# Altium schematic sheet analog_10V_sensors.SchDoc
size A4; SheetNumber: 6; SheetTotal: 12
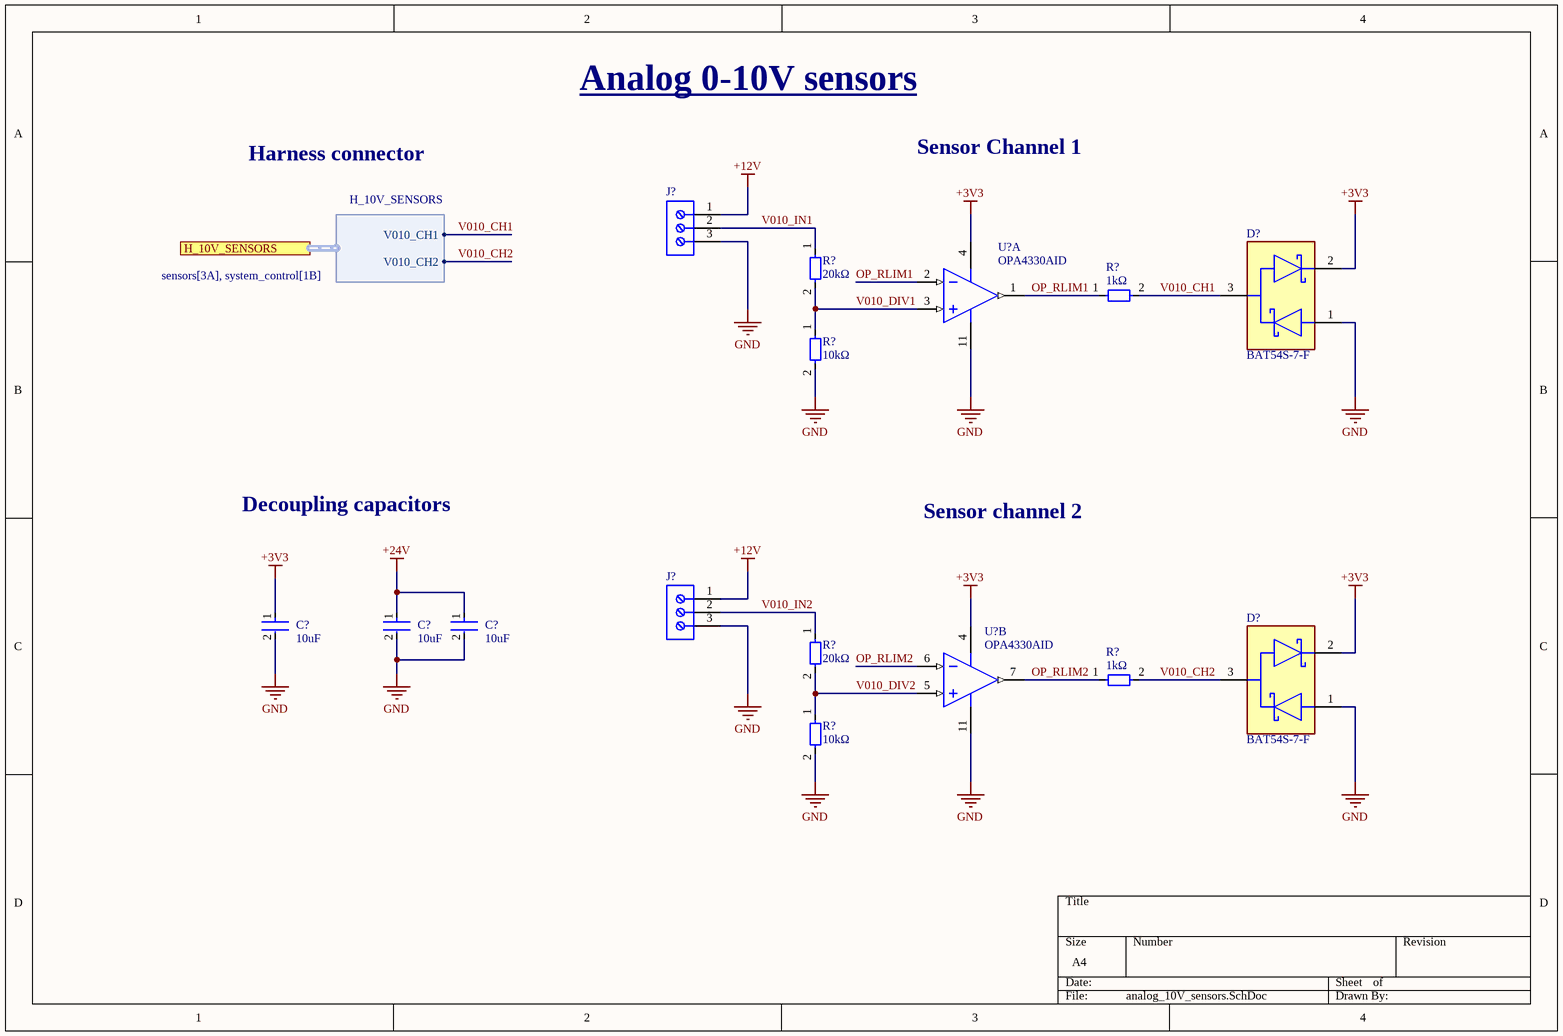
[diagram p0: analog_10V_sensors.SchDoc]

## Parts
(Parts that share a designator on the sheet are numbered #1, #2 ... from top to bottom, then left to right.)
C?#1  Capacitance: 10uF  [CAP_0805]  (hidden comment: Simbolo de capacitor genérico)
C?#2  Capacitance: 10uF  [CAP_0805]  (hidden comment: Simbolo de capacitor genérico)
C?#3  Capacitance: 10uF  [CAP_0805]  (hidden comment: Simbolo de capacitor genérico)
D?#1  BAT54S-7-F  [FP-SOT23-MFG]
D?#2  BAT54S-7-F  [FP-SOT23-MFG]
J?#1  691137710003  [691137710003]  (value not drawn)
J?#2  691137710003  [691137710003]  (value not drawn)
R?#1  value 20kΩ  [RES_0805]  (hidden comment: Simbolo de resistencia genérica)
R?#2  value 1kΩ  [RES_0805]  (hidden comment: Simbolo de resistencia genérica)
R?#3  value 10kΩ  [RES_0805]  (hidden comment: Simbolo de resistencia genérica)
R?#4  value 20kΩ  [RES_0805]  (hidden comment: Simbolo de resistencia genérica)
R?#5  value 1kΩ  [RES_0805]  (hidden comment: Simbolo de resistencia genérica)
R?#6  value 10kΩ  [RES_0805]  (hidden comment: Simbolo de resistencia genérica)
U?#1  OPA4330AID  [D0014A_N]  (part A of 4)
U?#2  OPA4330AID  [D0014A_N]  (part B of 4)

## Ports
H_10V_SENSORS (harness H_10V_SENSORS, see sensors[3A], system_control[1B])

## Harnesses
H_10V_SENSORS: V010_CH1, V010_CH2

## Nets
+3V3: C?#1.1 D?#1.2 D?#2.2 U?#1.4(V+) U?#2.4(V+)
+12V: J?#1.1 J?#2.1
+24V: C?#2.1 C?#3.1
GND: C?#1.2 C?#2.2 C?#3.2 D?#1.1 D?#2.1 J?#1.3 J?#2.3 R?#3.2 R?#6.2 U?#1.11(V-) U?#2.11(V-)
OP_RLIM1: R?#2.1 U?#1.1(OUT_A) U?#1.2(IN_A-)
OP_RLIM2: R?#5.1 U?#2.6(IN_B-) U?#2.7(OUT_B)
V010_CH1: D?#1.3 R?#2.2 ; port H_10V_SENSORS.V010_CH1
V010_CH2: D?#2.3 R?#5.2 ; port H_10V_SENSORS.V010_CH2
V010_DIV1: R?#1.2 R?#3.1 U?#1.3(IN_A+)
V010_DIV2: R?#4.2 R?#6.1 U?#2.5(IN_B+)
V010_IN1: J?#1.2 R?#1.1
V010_IN2: J?#2.2 R?#4.1

## Notes on the sheet
- Analog 0-10V sensors
- Harness connector
- Sensor Channel 1
- Decoupling capacitors
- Sensor channel 2

## Library data of the parts
C?#1-C?#3 = Generic C: Dielectric: X5R; Voltage Rating: 10V; Tolerance: 10%; Case Code (Imperial): 0805; Mount: Surface Mount; Depth: 1.25mm; Length: 2mm; Lead Free: Lead Free; Packaging: Tape and Reel; Width: 0.049inch; Package Quantity: 1; Height: 1.25mm; Case/Package: 0805; Thickness: 0.053inch; Max Operating Temperature: 85°C; Case Code (Metric): 2012; Contact Plating: Tin; Min Operating Temperature: -55°C; Radiation Hardening: No; Voltage Rating (DC): 10V
D?#1 D?#2 = CMP-1667-00006-2: DIODE ARRAY SCHOTTKY 30V SOT23-3; Forward Voltage: 800mV; Reverse Recovery Time: 5ns; Peak Non-Repetitive Surge Current: 600mA; Power Rating: 200mW; Current Rating: 200mA; Peak Reverse Current: 2uA; Capacitance: 10pF; Width: 1.3mm; Mount: Surface Mount; Height: 1mm; Number of Pins: 3; Weight: 0.000282oz; Max Reverse Voltage (DC): 30V; Max Power Dissipation: 200mW; Lead Free: Lead Free; Max Operating Temperature: 150°C; Min Operating Temperature: -65°C; Package Quantity: 3000; REACH SVHC: No SVHC; Termination: SMD/SMT; Max Forward Surge Current (Ifsm): 600mA; Radiation Hardening: No; Voltage Rating (DC): 30V; Average Rectified Current: 200mA; Max Repetitive Reverse Voltage (Vrrm): 30V; Contact Plating: Tin; Case/Package: SOT-23; Forward Current: 200mA; Power Dissipation: 200mW; Length: 2.9mm; Packaging: Tape and Reel
J?#1 J?#2 = CMP-1502-03325-2: NexarPartId: 78871138; Number of Pins: 3; Packaging: Box; RoHS: Non-Compliant; Lead Pitch: 5mm
R?#1-R?#6 = Generic R
U?#1 U?#2 = CMP-0272-00094-3: MicroPower, Precision, Zero Drift CMOS Operational Amplifier, 1.8 to 5.5 V, -40 to 125 degC, 14-pin SOIC (D14), Green (RoHS & no Sb/Br); Manufacturer: Texas Instruments; Iq per channel(Max)(mA): 0.035; Vio (25C)(Max)(mV): 0.05; Total Supply Voltage(Min)(+5V is 5, +/-5V is 10): 1.8; IIB(Max)(pA): 300; Number of Channels: 4; Total Supply Voltage(Max)(+5V is 5, +/-5V is 10): 5.5; Slew Rate(Typ)(V/us): 0.16; Offset Drift(Typ)(uV/C): 0.02; Vn at 1kHz(Typ)(nV/rtHz): 55; Sub Family: Low Offset Voltage Amplifier (<=500uV), Low Power Amp (<=500uA), Low Supply Voltage Amplifier (<=2.7V), Precision Amplifier; CMRR(Min)(dB): 100; ComponentLink2URL: http://www.ti.com/general/docs/lit/getliterature.tsp?genericPartNumber=OPA4330&fileType=pdf; PackageReference: D0014A; ComponentLink1Description: Manufacturer URL; ComponentLink1URL: http://www.ti.com/; PartNumber: OPA4330AID; ComponentLink2Description: Datasheet; DatasheetVersion: SBOS432E; Eco-Plan: Green (RoHS & no Sb/Br); ComponentLink3URL: http://www.ti.com/lit/ml/mpds177g/mpds177g.pdf; Mounting Technology: Surface Mount; ComponentLink3Description: Package Specification; PackageVersion: 4040047-5/M, 06/2011; PackageDescription: 14-Pin Plastic Small Outline, Body 8.65 x 3.9 mm, Pitch 1.27 mm; Code_JEDEC: MS-012